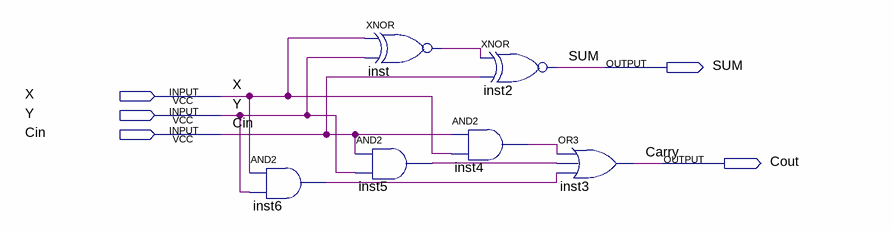
[diagram p0: schematic sheet]
// Quartus schematic full_adder.bdf as structural Verilog: 6 symbols, 5 pins
module full_adder (
  input  X,
  input  Y,
  input  Cin,
  output SUM,
  output Cout
);

  wire inst4_out, inst5_out, inst6_out, inst_out;

  and inst6 (inst6_out, X, Y);
  xnor inst (inst_out, X, Y);
  and inst5 (inst5_out, Cin, Y);
  xnor inst2 (SUM, inst_out, Cin);
  and inst4 (inst4_out, Cin, X);
  or inst3 (Cout, inst4_out, inst5_out, inst6_out);

  // Other names for the same wires on the sheet: Carry = Cout
endmodule
